# Altium schematic sheet DIOT_SMA_Supply.SchDoc: DIO-SMA
size 420 x 297 mm; Author: G.Kasprowicz; CompanyName: WUT ISE; DrawnBy: G.Kasprowicz; Organization: WUT ISE; Address1: PW ISE; Address2: Nowowiejska 15/19 00-665 Warsaw; Address3: gkasprow@gmail.com; DocumentNumber: 2; SheetNumber: 2; SheetTotal: 2; ModifiedBy: -; CheckedDate: -; DivGrp: WUT ISE; Designer: G.Kasprowicz; ModifiedDate: -; ProjectName: Sensor Box
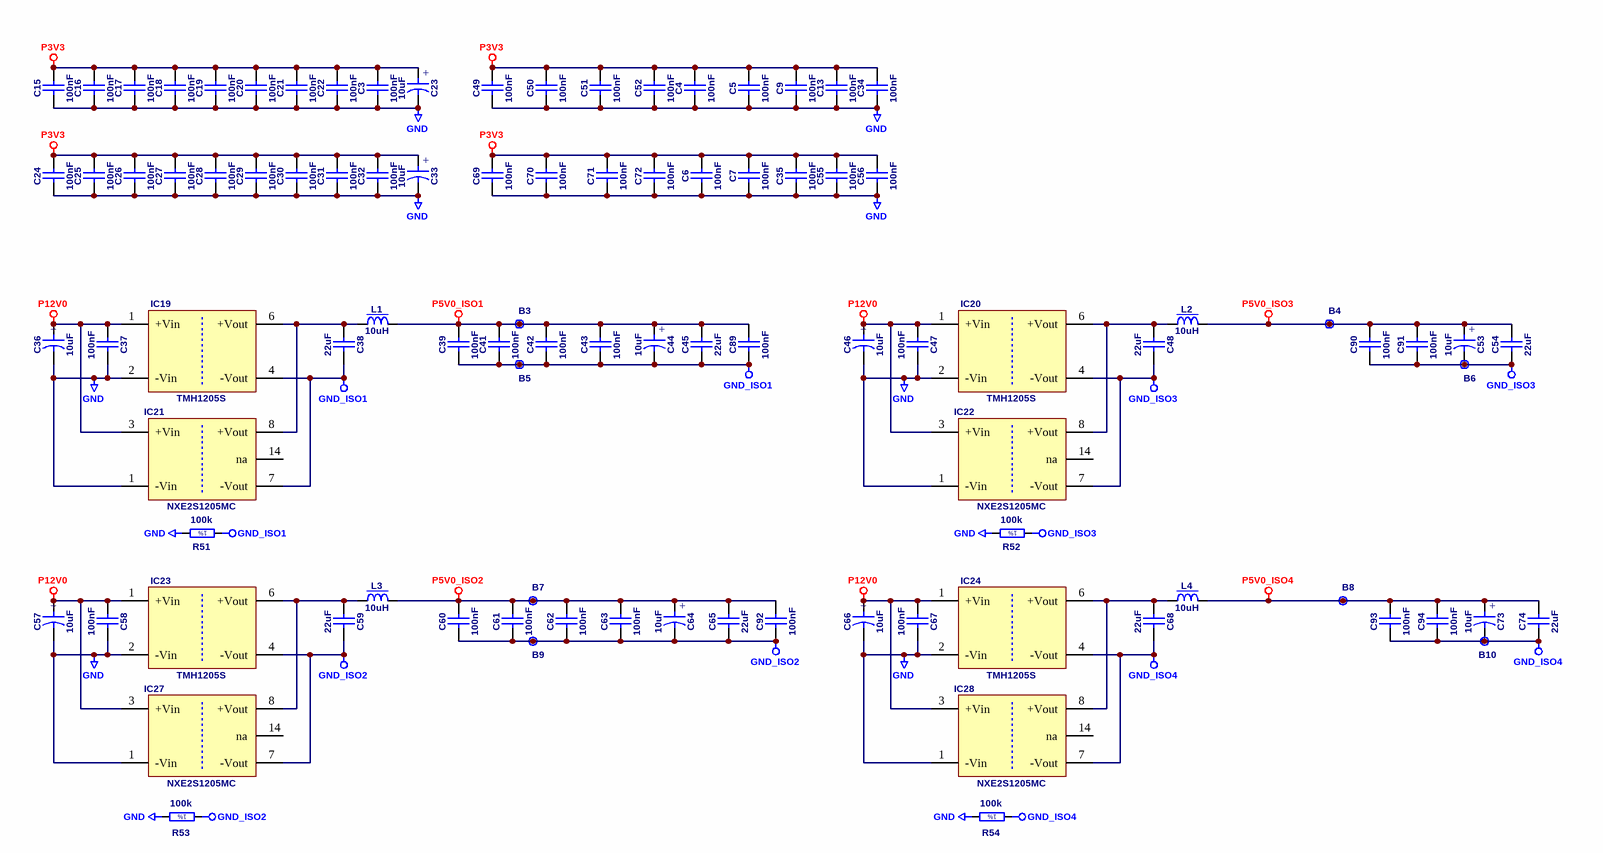
[diagram p0: DIOT_SMA_Supply.SchDoc]

## Parts
B3  Plated Hole  [c130h60]  (value not drawn)  (no BOM)
B4  Plated Hole  [c130h60]  (value not drawn)  (no BOM)
B5  Plated Hole  [c130h60]  (value not drawn)  (no BOM)
B6  Plated Hole  [c130h60]  (value not drawn)  (no BOM)
B7  Plated Hole  [c130h60]  (value not drawn)  (no BOM)
B8  Plated Hole  [c130h60]  (value not drawn)  (no BOM)
B9  Plated Hole  [c130h60]  (value not drawn)  (no BOM)
B10  Plated Hole  [c130h60]  (value not drawn)  (no BOM)
C3  100nF  [CAPC1005X55N]
C4  100nF  [CAPC1005X55N]
C5  100nF  [CAPC1005X55N]
C6  100nF  [CAPC1005X55N]
C7  100nF  [CAPC1005X55N]
C9  100nF  [CAPC1005X55N]
C13  100nF  [CAPC1005X55N]
C15  100nF  [CAPC1005X55N]
C16  100nF  [CAPC1005X55N]
C17  100nF  [CAPC1005X55N]
C18  100nF  [CAPC1005X55N]
C19  100nF  [CAPC1005X55N]
C20  100nF  [CAPC1005X55N]
C21  100nF  [CAPC1005X55N]
C22  100nF  [CAPC1005X55N]
C23  10uF  [CAPAE430X540N]
C24  100nF  [CAPC1005X55N]
C25  100nF  [CAPC1005X55N]
C26  100nF  [CAPC1005X55N]
C27  100nF  [CAPC1005X55N]
C28  100nF  [CAPC1005X55N]
C29  100nF  [CAPC1005X55N]
C30  100nF  [CAPC1005X55N]
C31  100nF  [CAPC1005X55N]
C32  100nF  [CAPC1005X55N]
C33  10uF  [CAPAE430X540N]
C34  100nF  [CAPC1005X55N]
C35  100nF  [CAPC1005X55N]
C36  10uF  [CAPAE430X540N]
C37  100nF  [CAPC1005X55N]
C38  22uF  [CAPC2012X135N]
C39  100nF  [CAPC1005X55N]
C41  100nF  [CAPC1005X55N]
C42  100nF  [CAPC1005X55N]
C43  100nF  [CAPC1005X55N]
C44  10uF  [CAPAE430X540N]
C45  22uF  [CAPC2012X135N]
C46  10uF  [CAPAE430X540N]
C47  100nF  [CAPC1005X55N]
C48  22uF  [CAPC2012X135N]
C49  100nF  [CAPC1005X55N]
C50  100nF  [CAPC1005X55N]
C51  100nF  [CAPC1005X55N]
C52  100nF  [CAPC1005X55N]
C53  10uF  [CAPAE430X540N]
C54  22uF  [CAPC2012X135N]
C55  100nF  [CAPC1005X55N]
C56  100nF  [CAPC1005X55N]
C57  10uF  [CAPAE430X540N]
C58  100nF  [CAPC1005X55N]
C59  22uF  [CAPC2012X135N]
C60  100nF  [CAPC1005X55N]
C61  100nF  [CAPC1005X55N]
C62  100nF  [CAPC1005X55N]
C63  100nF  [CAPC1005X55N]
C64  10uF  [CAPAE430X540N]
C65  22uF  [CAPC2012X135N]
C66  10uF  [CAPAE430X540N]
C67  100nF  [CAPC1005X55N]
C68  22uF  [CAPC2012X135N]
C69  100nF  [CAPC1005X55N]
C70  100nF  [CAPC1005X55N]
C71  100nF  [CAPC1005X55N]
C72  100nF  [CAPC1005X55N]
C73  10uF  [CAPAE430X540N]
C74  22uF  [CAPC2012X135N]
C89  100nF  [CAPC1005X55N]
C90  100nF  [CAPC1005X55N]
C91  100nF  [CAPC1005X55N]
C92  100nF  [CAPC1005X55N]
C93  100nF  [CAPC1005X55N]
C94  100nF  [CAPC1005X55N]
IC19  TMH1205S  [DCDC_TRACO_TMA]
IC20  TMH1205S  [DCDC_TRACO_TMA]
IC21  NXE2S1205MC  [DCDC_MURATA_NXE2]
IC22  NXE2S1205MC  [DCDC_MURATA_NXE2]
IC23  TMH1205S  [DCDC_TRACO_TMA]
IC24  TMH1205S  [DCDC_TRACO_TMA]
IC27  NXE2S1205MC  [DCDC_MURATA_NXE2]
IC28  NXE2S1205MC  [DCDC_MURATA_NXE2]
L1  10uH  [IND_MURATA-PS_8400]
L2  10uH  [IND_MURATA-PS_8400]
L3  10uH  [IND_MURATA-PS_8400]
L4  10uH  [IND_MURATA-PS_8400]
R51  100k  [RESC2012X60N]
R52  100k  [RESC2012X60N]
R53  100k  [RESC2012X60N]
R54  100k  [RESC2012X60N]

## Nets
GND: C3.1 C4.1 C5.1 C6.1 C7.1 C9.1 C13.1 C15.1 C16.1 C17.1 C18.1 C19.1 C20.1 C21.1 C22.1 C23.2 C24.1 C25.1 C26.1 C27.1 C28.1 C29.1 C30.1 C31.1 C32.1 C33.2 C34.1 C35.1 C36.2 C37.1 C46.2 C47.1 C49.1 C50.1 C51.1 C52.1 C55.1 C56.1 C57.2 C58.1 C66.2 C67.1 C69.1 C70.1 C71.1 C72.1 IC19.2(-Vin) IC20.2(-Vin) IC21.1(-Vin) IC22.1(-Vin) IC23.2(-Vin) IC24.2(-Vin) IC27.1(-Vin) IC28.1(-Vin) R51.2 R52.2 R53.2 R54.2
GND_ISO1: B5.1 C38.1 C39.1 C41.1 C42.1 C43.1 C44.2 C45.1 C89.1 IC19.4(-Vout) IC21.7(-Vout) R51.1
GND_ISO2: B9.1 C59.1 C60.1 C61.1 C62.1 C63.1 C64.2 C65.1 C92.1 IC23.4(-Vout) IC27.7(-Vout) R53.1
GND_ISO3: B6.1 C48.1 C53.2 C54.1 C90.1 C91.1 IC20.4(-Vout) IC22.7(-Vout) R52.1
GND_ISO4: B10.1 C68.1 C73.2 C74.1 C93.1 C94.1 IC24.4(-Vout) IC28.7(-Vout) R54.1
P3V3: C3.2 C4.2 C5.2 C6.2 C7.2 C9.2 C13.2 C15.2 C16.2 C17.2 C18.2 C19.2 C20.2 C21.2 C22.2 C23.1 C24.2 C25.2 C26.2 C27.2 C28.2 C29.2 C30.2 C31.2 C32.2 C33.1 C34.2 C35.2 C49.2 C50.2 C51.2 C52.2 C55.2 C56.2 C69.2 C70.2 C71.2 C72.2
P5V0_ISO1: B3.1 C39.2 C41.2 C42.2 C43.2 C44.1 C45.2 C89.2 L1.1
P5V0_ISO2: B7.1 C60.2 C61.2 C62.2 C63.2 C64.1 C65.2 C92.2 L3.1
P5V0_ISO3: B4.1 C53.1 C54.2 C90.2 C91.2 L2.1
P5V0_ISO4: B8.1 C73.1 C74.2 C93.2 C94.2 L4.1
P12V0: C36.1 C37.2 C46.1 C47.2 C57.1 C58.2 C66.1 C67.2 IC19.1(+Vin) IC20.1(+Vin) IC21.3(+Vin) IC22.3(+Vin) IC23.1(+Vin) IC24.1(+Vin) IC27.3(+Vin) IC28.3(+Vin)
NetC38_2: C38.2 IC19.6(+Vout) IC21.8(+Vout) L1.2
NetC48_2: C48.2 IC20.6(+Vout) IC22.8(+Vout) L2.2
NetC59_2: C59.2 IC23.6(+Vout) IC27.8(+Vout) L3.2
NetC68_2: C68.2 IC24.6(+Vout) IC28.8(+Vout) L4.2

Not connected (* = marked no-connect by the designer): IC21 14(na); IC22 14(na); IC27 14(na); IC28 14(na)

## Notes on the sheet
- Project/Equipment
- Document
- Designer
- Drawn by
- Check.by
- Copyright WUT ISE 2020.
  This documentation describes Open Hardware and is licensed under the CERN OHL v.1.2. You may redistribute and modify this documentation under the terms of the CERN OHL v.1.2. (http://ohwr.org/CERNOHL). This documentation is distributed WITHOUT ANY EXPRESS OR IMPLIED WARRANTY, INCLUDING OF MERCHANTABILITY, SATISFACTORY QUALITY AND FITNESS FOR A PARTICULAR PURPOSE. Please see the CERN OHL v.1.2 for applicable conditions.
- Contact
- File
- Last Mod.
- Print Date
- Sheet
- Size
- A3
- of
- Rev
- (in symbol CAE430-540_10UF_16V_20%) +
- (in symbol R0805_100K_1%_0.125W_100PPM) 1%

## Library data of the parts
B3-B10 = PLATED_HOLE0.6_PAD1.3: Single Terminal Socket; Part Description: Plated Through Hole: Hole Dia.=0.6mm Pad Dia.=1.3mm; Mounted: No; Part Number: PLATED_HOLE0.6_PAD1.3; Component Type: Standard (No BOM); Pin Count: 1; Family: Plated Hole; Socket: No; SMD: No; Sense: No; Status: None; ComponentHeight: 0mm; HelpURL: Undefined; Author: CERN DEM MR; CreateDate: 02.03.2016; LatestRevisionDate: 02.03.2016; PackageDescription: Plated Through Hole: Hole Dia.=0.6mm Pad Dia.=1.3mm
C3-C7 C9 C13 C15-C22 C24-C32 C34 C35 C37 C39 C41-C43 C47 C49-C52 C55 C56 C58 C60-C63 C67 C69-C72 C89-C94 = CC0402_100NF_16V_10%_X5R: Non-polarised capacitor; Part Description: SMD Multilayer Chip Ceramic Capacitor; Manufacturer: GENERIC; Manufacturer1 Part Number: GRM155R61C104KA88D; Voltage: 16V; TC: X5R; Tolerance: ±10%; Part Number: CC0402_100NF_16V_10%_X5R; Component Kind: Standard; Component Type: Standard; Pin Count: 2; Value: 100nF; Status: None; Manufacturer Part Number: CC0402_100NF_16V_10%_X5R; Case: 0402; Mounted: Yes; Socket: No; SMD: Yes; Sense: No; Manufacturer1 Example: MURATA; Manufacturer1 ComponentHeight: 0.55mm; HelpURL: \\cern.ch\dfs\Applications\Altium\Datasheets\CC0402_X5R_MURATA_GRM.pdf; Author: CERN DEM JLC; CreateDate: 10.12.2013; LatestRevisionDate: 10.12.2013
C23 C33 C36 C44 C46 C53 C57 C64 C66 C73 = CAE430-540_10UF_16V_20%: Polarised capacitor; Part Description: Aluminum Electrolytic SMT Capacitor; Manufacturer: PANASONIC; Manufacturer Part Number: EEEFK1C100AR; Voltage: 16V; Tolerance: ±20%; Part Number: CAE430-540_10UF_16V_20%; Component Kind: Standard; Component Type: Standard; Pin Count: 2; Value: 10uF; Status: Not Recommended; Case: B; Mounted: Yes; Socket: No; SMD: Yes; Sense: No; ComponentHeight: 5.8mm; HelpURL: \\cern.ch\dfs\Applications\Altium\Datasheets\CAE_PANASONIC_FK.pdf; Author: CERN DEM JLC; CreateDate: 03.12.2007; LatestRevisionDate: 05.11.2014
C38 C45 C48 C54 C59 C65 C68 C74 = CC0805_22UF_16V_10%_X5R: Non-polarised capacitor; Part Description: SMD Multilayer Chip Ceramic Capacitor; Manufacturer: GENERIC; Manufacturer1 Part Number: C2012X5R1C226KT; Voltage: 16V; TC: X5R; Tolerance: ±10%; Part Number: CC0805_22UF_16V_10%_X5R; Component Kind: Standard; Component Type: Standard; Pin Count: 2; Value: 22uF; Status: Preferred; Manufacturer Part Number: CC0805_22UF_16V_10%_X5R; Case: 0805; Mounted: Yes; Socket: No; SMD: Yes; Sense: No; Manufacturer1 Example: TDK; Manufacturer1 ComponentHeight: 1.35mm; HelpURL: \\cern.ch\dfs\Applications\Altium\Datasheets\CC0805_X5R_TDK_C.pdf; Author: CERN DEM JLC; CreateDate: 25.10.2012; LatestRevisionDate: 25.10.2012
IC19 IC20 IC23 IC24 = DC/DC_TRACO_TMH1205S: 12V ±10% to 5V, Iout (max) 400mA, 2W DC-DC Converter; Manufacturer: TRACO POWER; PressFit: No; Bonding: No; Part Number: TMH1205S; Component Kind: Standard; Component Type: Standard; Device: TMH1205S; PackageDescription: TMA Series, Body 19.5x6.1mm, SIP-6, Unregulated; Part Description: 12V ±10% to 5V, Iout (max) 400mA, 2W DC-DC Converter; Manufacturer Part Number: TMH1205S; Pin Count: 4; Mounted: Yes; Socket: No; SMD: No; Sense: No; ComponentHeight: 10.45mm; HelpURL: \\cern.ch\dfs\Applications\Altium\Datasheets\TMA 0505S.pdf; Author: GK; CreateDate: 17.12.2016; LatestRevisionDate: 17.12.2016
IC21 IC22 IC27 IC28 = DCDC_MURATA_NXE2S1205MC: MURATA, NXE2 Serie, Dual Output DCDC Converter; Part Description: 12V to 5V, Iout (max) 400mA, 3kVDC Isolated, 2W Dual Output DC-DC Converter; Manufacturer: MURATA POWER SOLUTIONS; PressFit: No; Bonding: No; Part Number: NXE2S1205MC; Component Kind: Standard; Component Type: Standard; Device: NXE2S1205MC; PackageDescription: NXE2 Series, Body 12.7 x 10.4, Height 4.4mm; Manufacturer Part Number: NXE2S1205MC; Pin Count: 5; Mounted: Yes; Socket: No; SMD: Yes; Sense: No; ComponentHeight: 4.4mm; HelpURL: \\cern.ch\dfs\Applications\Altium\Datasheets\MTU1D1215MC.pdf; Author: CERN DEM MR; CreateDate: 16.01.2017; LatestRevisionDate: 16.01.2017
L1-L4 = IND_10UH_10%_MURATA-PS_8400: Inductor With Core; Part Description: Miniature Surface Mount Power Inductor (8400 Serie); Manufacturer: MURATA POWER SOLUTIONS; Manufacturer Part Number: 84103C; Power: 950mA; Resistance: 0.24R; Tolerance: ±10%; Part Number: IND_10UH_10%_MURATA-PS_8400; Component Kind: Standard; Component Type: Standard; Pin Count: 2; Value: 10uH; Status: None; Mounted: Yes; Socket: No; SMD: Yes; Sense: No; ComponentHeight: 2.9mm; HelpURL: \\cern.ch\dfs\Applications\Altium\Datasheets\IND_MURATA-PS_8400.pdf; Author: CERN DEM JLC; CreateDate: 02.07.2012; LatestRevisionDate: 02.07.2012
R51-R54 = R0805_100K_1%_0.125W_100PPM: Resistor - 1%; Part Description: General Purpose Thick Film Chip Resistor; Manufacturer: GENERIC; Manufacturer1 Part Number: NRC10F1003TRF; Power: 0.125W; TC: ±100ppm/°C; PressFit: No; Part Number: R0805_100K_1%_0.125W_100PPM; Component Kind: Standard; Component Type: Standard; Pin Count: 2; Value: 100k; Status: Preferred; Tolerance: ±1%; Manufacturer Part Number: R0805_100K_1%_0.125W_100PPM; Case: 0805; Mounted: Yes; Sense: No; Socket: No; SMD: Yes; Manufacturer1 Example: NIC COMPONENT; Manufacturer1 ComponentHeight: 0.6mm; HelpURL: \\cern.ch\dfs\Applications\Altium\Datasheets\R0805_NIC_NRC.pdf; Author: CERN DEM JLC; CreateDate: 03.12.2007; LatestRevisionDate: 13.03.2008